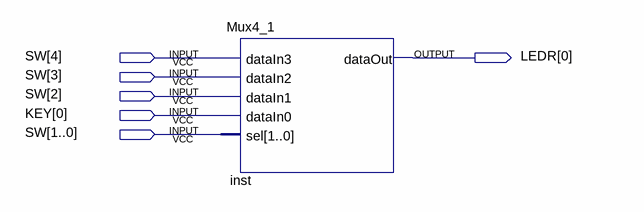
[diagram p0: schematic sheet]
// Quartus schematic Mux4_1.bdf as structural Verilog: 1 symbols, 6 pins
module Mux4_1 (
  input  [4:0] SW,
  input  [0:0] KEY,
  output [0:0] LEDR
);

  Mux4_1 inst (.dataIn3(SW[4]), .dataIn2(SW[3]), .dataIn1(SW[2]), .dataIn0(KEY[0]), .sel(SW[1:0]), .dataOut(LEDR[0]));
endmodule
